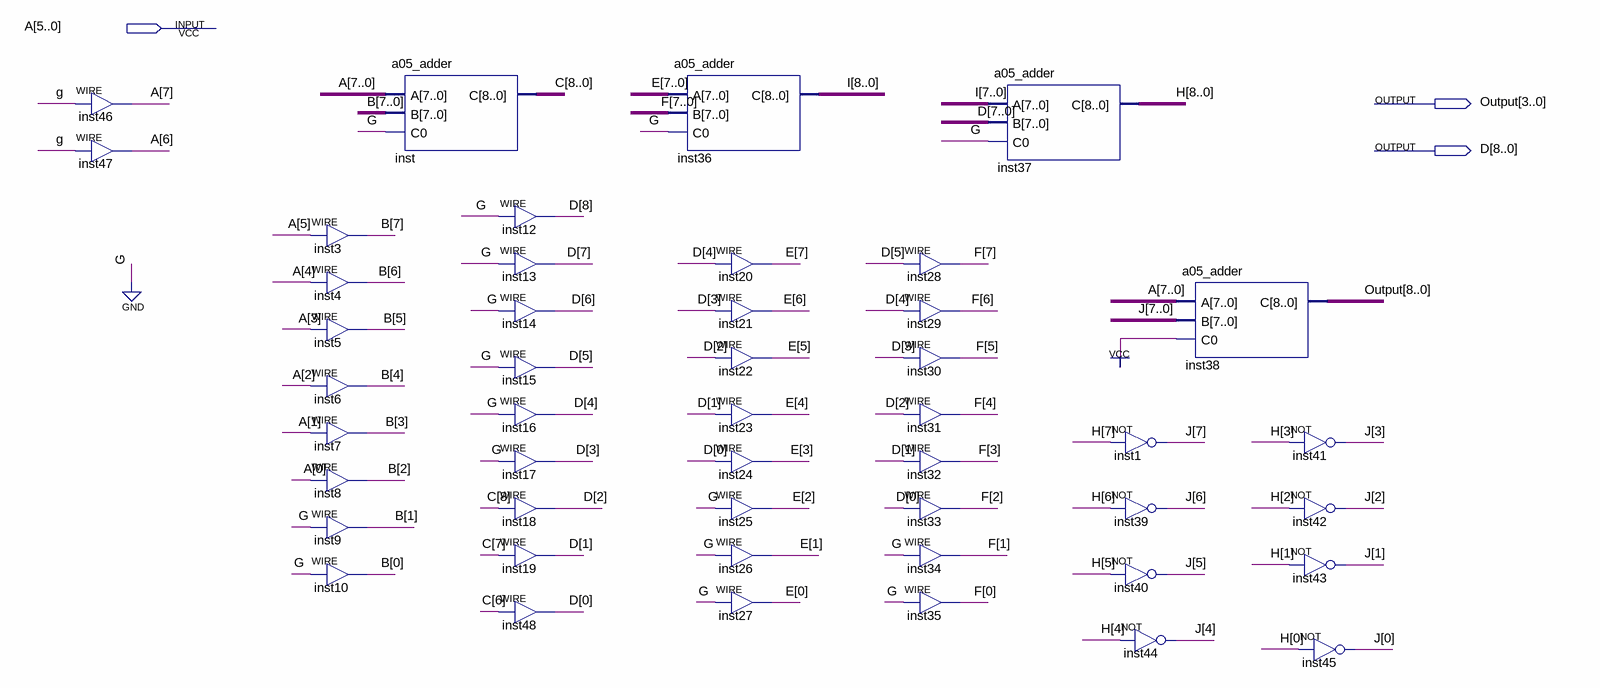
[diagram p0: schematic sheet]
// Quartus schematic a05_Modulo_13.bdf as structural Verilog: 47 symbols, 3 pins
module a05_Modulo_13 (
  input  [7:0] A,
  output [8:0] Output,
  output [8:0] D
);

  wire [7:0] B, E, F, J;
  wire [8:0] C, H, I;

  assign A[7] = 1'b0;  // WIRE inst46
  assign A[6] = 1'b0;  // WIRE inst47
  assign B[7] = A[5];  // WIRE inst3
  assign B[6] = A[4];  // WIRE inst4
  assign B[5] = A[3];  // WIRE inst5
  assign B[4] = A[2];  // WIRE inst6
  assign B[3] = A[1];  // WIRE inst7
  assign B[2] = A[0];  // WIRE inst8
  assign B[1] = 1'b0;  // WIRE inst9
  assign B[0] = 1'b0;  // WIRE inst10
  a05_adder inst (.A(A), .B(B), .C0(1'b0), .C(C));
  assign D[8] = 1'b0;  // WIRE inst12
  assign D[7] = 1'b0;  // WIRE inst13
  assign D[6] = 1'b0;  // WIRE inst14
  assign D[5] = 1'b0;  // WIRE inst15
  assign D[4] = 1'b0;  // WIRE inst16
  assign D[3] = 1'b0;  // WIRE inst17
  assign D[2] = C[8];  // WIRE inst18
  assign D[1] = C[7];  // WIRE inst19
  assign D[0] = C[6];  // WIRE inst48
  a05_adder inst36 (.A(E), .B(F), .C0(1'b0), .C(I));
  assign E[7] = D[4];  // WIRE inst20
  assign E[6] = D[3];  // WIRE inst21
  assign E[5] = D[2];  // WIRE inst22
  assign E[4] = D[1];  // WIRE inst23
  assign E[3] = D[0];  // WIRE inst24
  assign E[2] = 1'b0;  // WIRE inst25
  assign E[1] = 1'b0;  // WIRE inst26
  assign E[0] = 1'b0;  // WIRE inst27
  assign F[7] = D[5];  // WIRE inst28
  assign F[6] = D[4];  // WIRE inst29
  assign F[5] = D[3];  // WIRE inst30
  assign F[4] = D[2];  // WIRE inst31
  assign F[3] = D[1];  // WIRE inst32
  assign F[2] = D[0];  // WIRE inst33
  assign F[1] = 1'b0;  // WIRE inst34
  assign F[0] = 1'b0;  // WIRE inst35
  a05_adder inst37 (.A(I[7:0]), .B(D[7:0]), .C0(1'b0), .C(H));
  not inst1 (J[7], H[7]);
  not inst39 (J[6], H[6]);
  not inst40 (J[5], H[5]);
  a05_adder inst38 (.A(A), .B(J), .C0(1'b1), .C(Output));
  not inst44 (J[4], H[4]);
  not inst41 (J[3], H[3]);
  not inst42 (J[2], H[2]);
  not inst43 (J[1], H[1]);
  not inst45 (J[0], H[0]);
endmodule
